# Altium schematic sheet SCH For IN12の世界线MCU.SchDoc
size A3
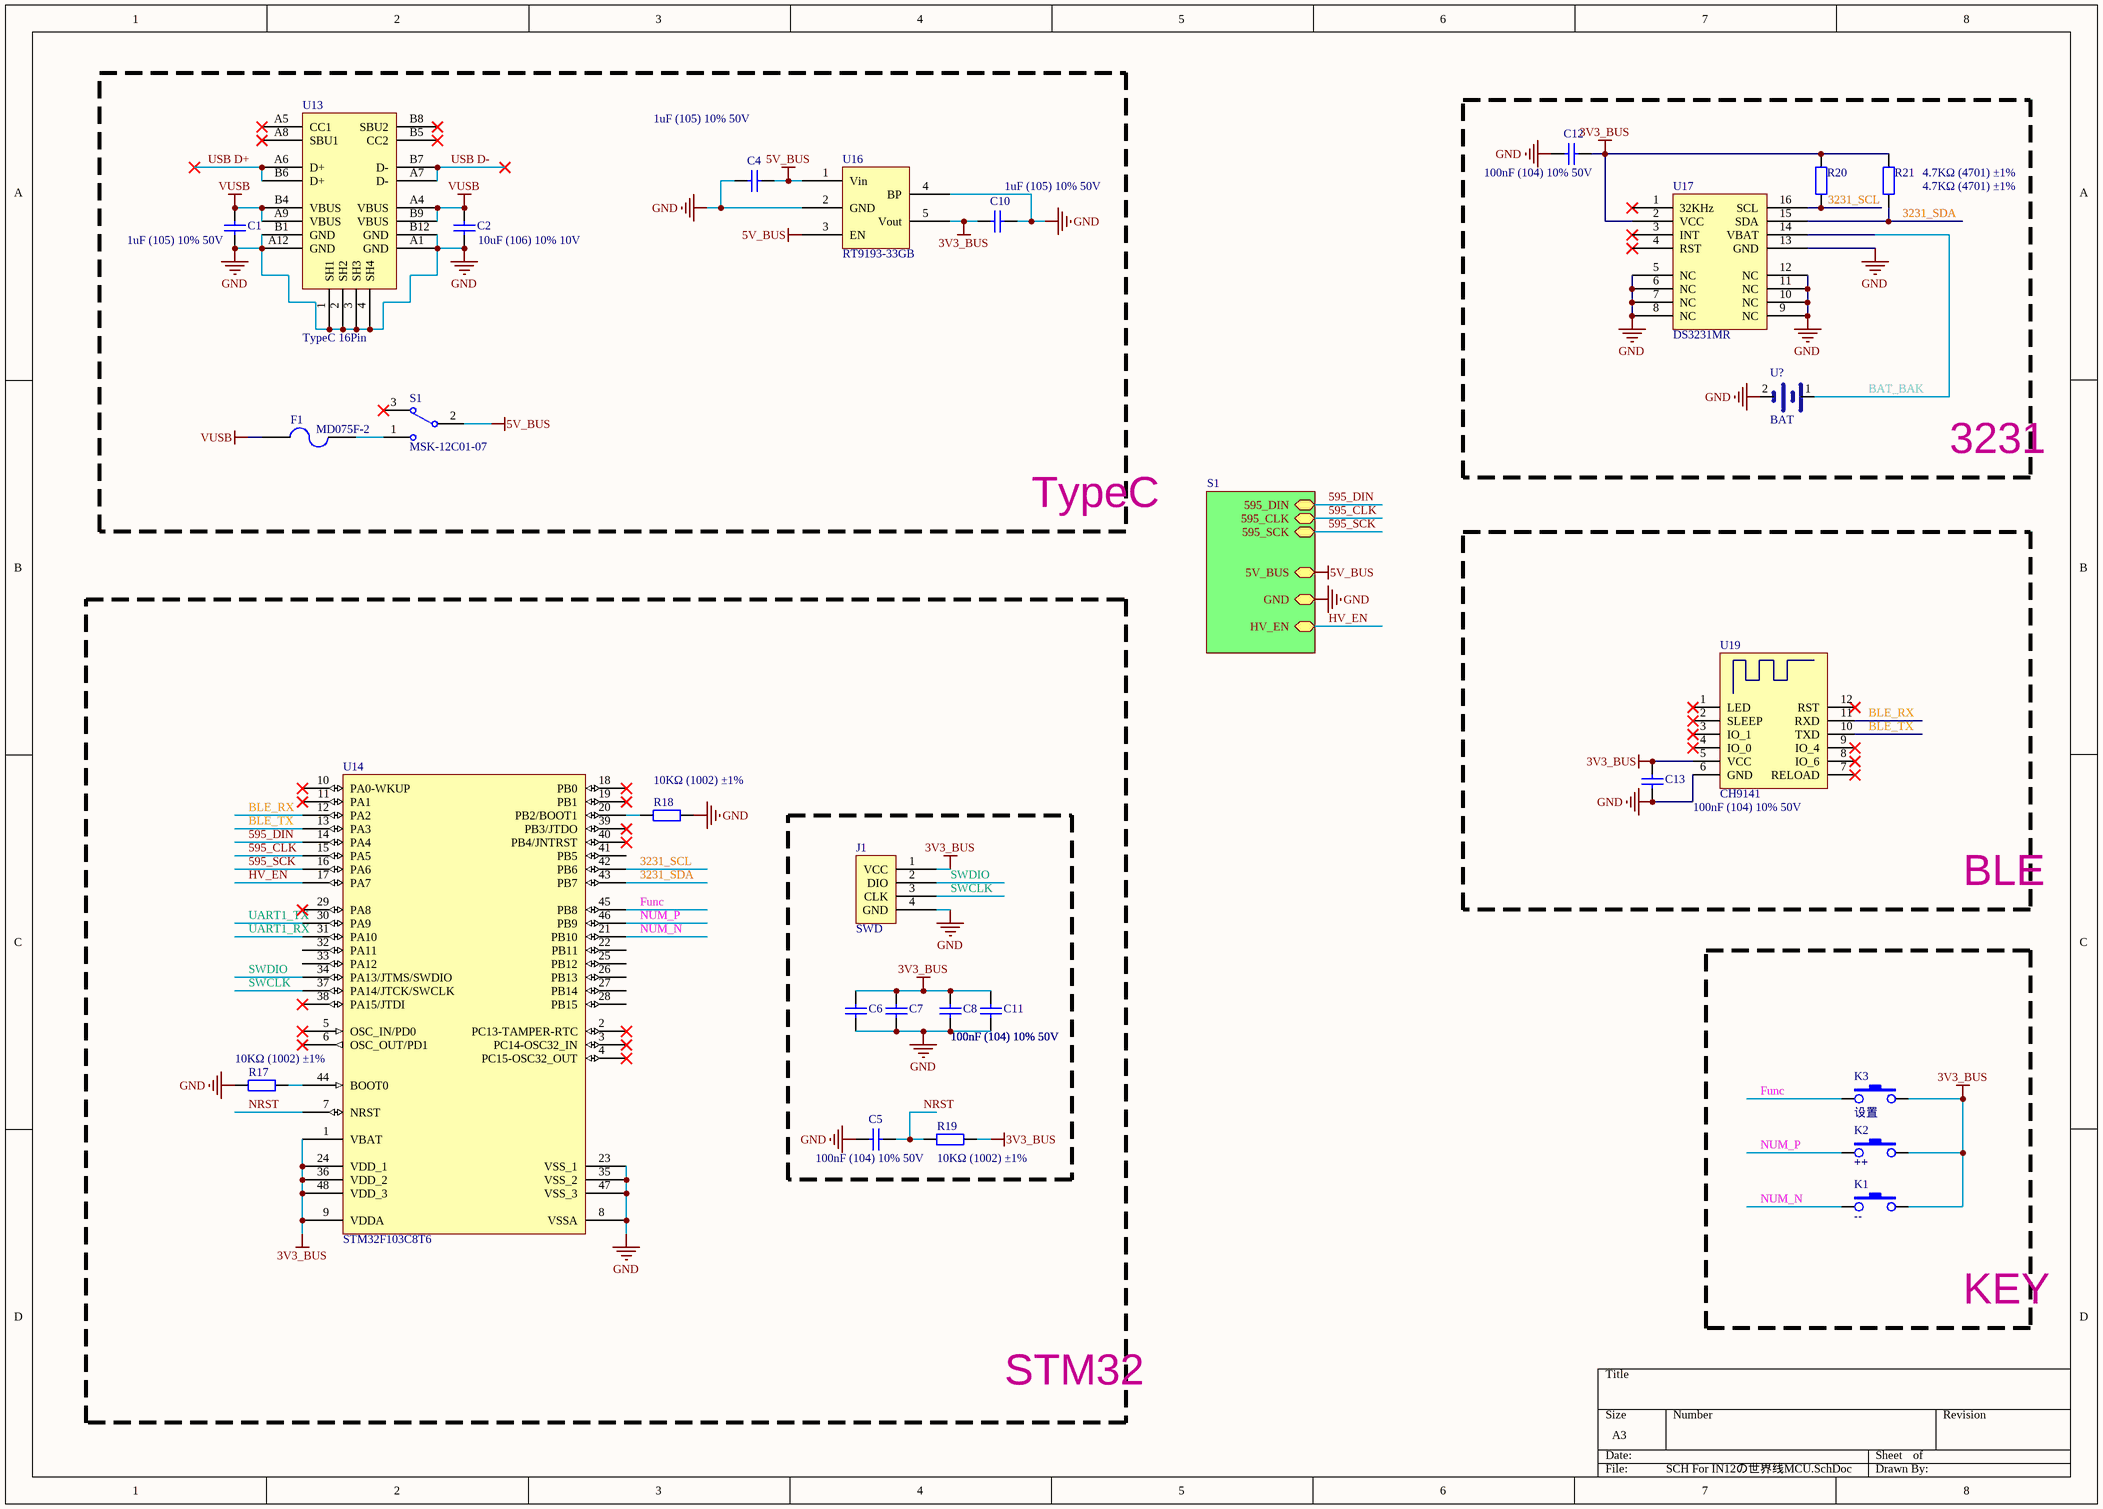
[diagram p0: SCH For IN12の世界线MCU.SchDoc]

## Parts
C1  1uF (105) 10% 50V  [LC-0603_C]
C2  10uF (106) 10% 10V  [LC-0603_C]
C4  1uF (105) 10% 50V  [LC-0603_C]
C5  100nF (104) 10% 50V  [LC-0603_C]
C6  100nF (104) 10% 50V  [LC-0603_C]
C7  100nF (104) 10% 50V  [LC-0603_C]
C8  100nF (104) 10% 50V  [LC-0603_C]
C10  1uF (105) 10% 50V  [LC-0603_C]
C11  100nF (104) 10% 50V  [LC-0603_C]
C12  100nF (104) 10% 50V  [LC-0603_C]
C13  100nF (104) 10% 50V  [LC-0603_C]
F1  MD075F-2  [FUSE-1210]
J1  SWD  [Header 2.54X4]
K1  --  [SMD-12X12X6]
K2  ++  [SMD-12X12X6]
K3  设置  [SMD-12X12X6]
R17  10KΩ (1002) ±1%  [LC-0603_R]
R18  10KΩ (1002) ±1%  [LC-0603_R]
R19  10KΩ (1002) ±1%  [LC-0603_R]
R20  4.7KΩ (4701) ±1%  [LC-0603_R]
R21  4.7KΩ (4701) ±1%  [LC-0603_R]
S1  MSK-12C01-07  [SW_SK12D07]
U13  TypeC 16Pin  [Type-C]
U14  STM32F103C8T6  [LQFP48 7X7]
U16  RT9193-33GB  [SOT23_5]
U17  DS3231MR  [SOIC_16W]
U19  CH9141  [BLE-SER]
U?  BAT  [ML621FE]

## Blocks framed on the sheet
TypeC: C1 C2 C4 C10 F1 S1 U13 U16
3231: C12 R20 R21 U17 U?
BLE: C13 U19
STM32: C5-C8 C11 J1 R17-R19 U14
KEY: K1-K3

## Sub-sheets
S1 = SCH For IN12の世界线.SchDoc: 595_CLK, 595_DIN, 595_SCK, 5V_BUS, GND, HV_EN

## Nets
3V3_BUS: C6.2 C7.2 C8.2 C10.1 C11.2 C12.2 C13.2 J1.1(VCC) K1.3 K2.3 K3.3 R19.2 R20.2 R21.2 U14.1(VBAT) U14.9(VDDA) U14.24(VDD_1) U14.36(VDD_2) U14.48(VDD_3) U16.5(Vout) U17.2(VCC) U19.5(VCC)
5V_BUS: C4.1 S1.2 U16.1(Vin) U16.3(EN) ; sheet S1/5V_BUS
GND: C1.1 C2.1 C4.2 C5.1 C6.1 C7.1 C8.1 C10.2 C11.1 C12.1 C13.1 J1.4(GND) R17.2 R18.2 U13.1(SH1) U13.2(SH2) U13.3(SH3) U13.4(SH4) U13.A1(GND) U13.A12(GND) U13.B1(GND) U13.B12(GND) U14.8(VSSA) U14.23(VSS_1) U14.35(VSS_2) U14.47(VSS_3) U16.2(GND) U16.4(BP) U17.5(NC) U17.6(NC) U17.7(NC) U17.8(NC) U17.9(NC) U17.10(NC) U17.11(NC) U17.12(NC) U17.13(GND) U19.6(GND) U?.2(-) ; sheet S1/GND
VUSB: C1.2 C2.2 F1.1 U13.A4(VBUS) U13.A9(VBUS) U13.B4(VBUS) U13.B9(VBUS)
595_CLK: U14.15(PA5) ; sheet S1/595_CLK
595_DIN: U14.14(PA4) ; sheet S1/595_DIN
595_SCK: U14.16(PA6) ; sheet S1/595_SCK
3231_SCL: R20.1 U14.42(PB6) U17.16(SCL)
3231_SDA: R21.1 U14.43(PB7) U17.15(SDA)
BAT_BAK: U17.14(VBAT) U?.1(+)
BLE_RX: U14.12(PA2) U19.11(RXD)
BLE_TX: U14.13(PA3) U19.10(TXD)
Func: K3.1 U14.45(PB8)
HV_EN: U14.17(PA7) ; sheet S1/HV_EN
NRST: C5.2 R19.1 U14.7(NRST)
NUM_N: K1.1 U14.21(PB10)
NUM_P: K2.1 U14.46(PB9)
SWCLK: J1.3(CLK) U14.37(PA14/JTCK/SWCLK)
SWDIO: J1.2(DIO) U14.34(PA13/JTMS/SWDIO)
UART1_RX: U14.31(PA10)
UART1_TX: U14.30(PA9)
USB D+: U13.A6(D+) U13.B6(D+)
USB D-: U13.A7(D-) U13.B7(D-)
NetF1_2: F1.2 S1.1
NetR17_1: R17.1 U14.44(BOOT0)
NetR18_1: R18.1 U14.20(PB2/BOOT1)

Not connected (* = marked no-connect by the designer): S1 3*; U13 A5(CC1)* A8(SBU1)* B5(CC2)* B8(SBU2)*; U14 2(PC13-TAMPER-RTC)* 3(PC14-OSC32_IN)* 4(PC15-OSC32_OUT)* 5(OSC_IN/PD0)* 6(OSC_OUT/PD1)* 10(PA0-WKUP)* 11(PA1)* 18(PB0)* 19(PB1)* 22(PB11) 25(PB12) 26(PB13) 27(PB14) 28(PB15) 29(PA8)* 32(PA11) 33(PA12) 38(PA15/JTDI)* 39(PB3/JTDO)* 40(PB4/JNTRST)* 41(PB5); U17 1(32KHz)* 3(INT)* 4(RST)*; U19 1(LED)* 2(SLEEP)* 3(IO_1)* 4(IO_0)* 7(RELOAD)* 8(IO_6)* 9(IO_4)* 12(RST)*

## Library data of the parts
C1 C4 C10 = 0603 1uF (105) 10% 50V: 贴片电容; ComponentLink1Description: 供应商链接; ComponentLink1URL: http://www.szlcsc.com/product/details_16531.html; Package: 0603; Supplier: LC; SuppliersPartNumber: C15849
C2 = 0603 10uF (106) 10% 10V: 贴片电容; ComponentLink1Description: 供应商链接; ComponentLink1URL: http://www.szlcsc.com/product/details_20411.html; Package: 0603; Supplier: LC; SuppliersPartNumber: C19702
C5-C8 C11-C13 = 0603 100nF (104) 10% 50V: 贴片电容; ComponentLink1Description: 供应商链接; ComponentLink1URL: http://www.szlcsc.com/product/details_15331.html; Package: 0603; Supplier: LC; SuppliersPartNumber: C14663
F1 = FUSE
J1 = SWD: STM32 SWD下载
K1-K3 = KEY
R17-R19 = 0603 10KΩ (1002) 1%: 贴片电阻; ComponentLink1Description: 供应商链接; ComponentLink1URL: http://www.szlcsc.com/product/details_26547.html; Package: 0603; Supplier: LC; SuppliersPartNumber: C25804
R20 R21 = 0603 4.7KΩ (4701) 1%: 贴片电阻; ComponentLink1Description: 供应商链接; ComponentLink1URL: http://www.szlcsc.com/product/details_23889.html; Package: 0603; Supplier: LC; SuppliersPartNumber: C23162
U13 = TypeC
U16 = RT9193-33GB: 3.3V/300mA低压差LDO
U17 = DS3231: 实时时钟芯片
U19 = CH9141: WCH沁恒低功耗BLE蓝牙